# EAGLE design SparkFun_Air_Quality_ENS160_Qwiic_Micro (EAGLE 9.6.2)
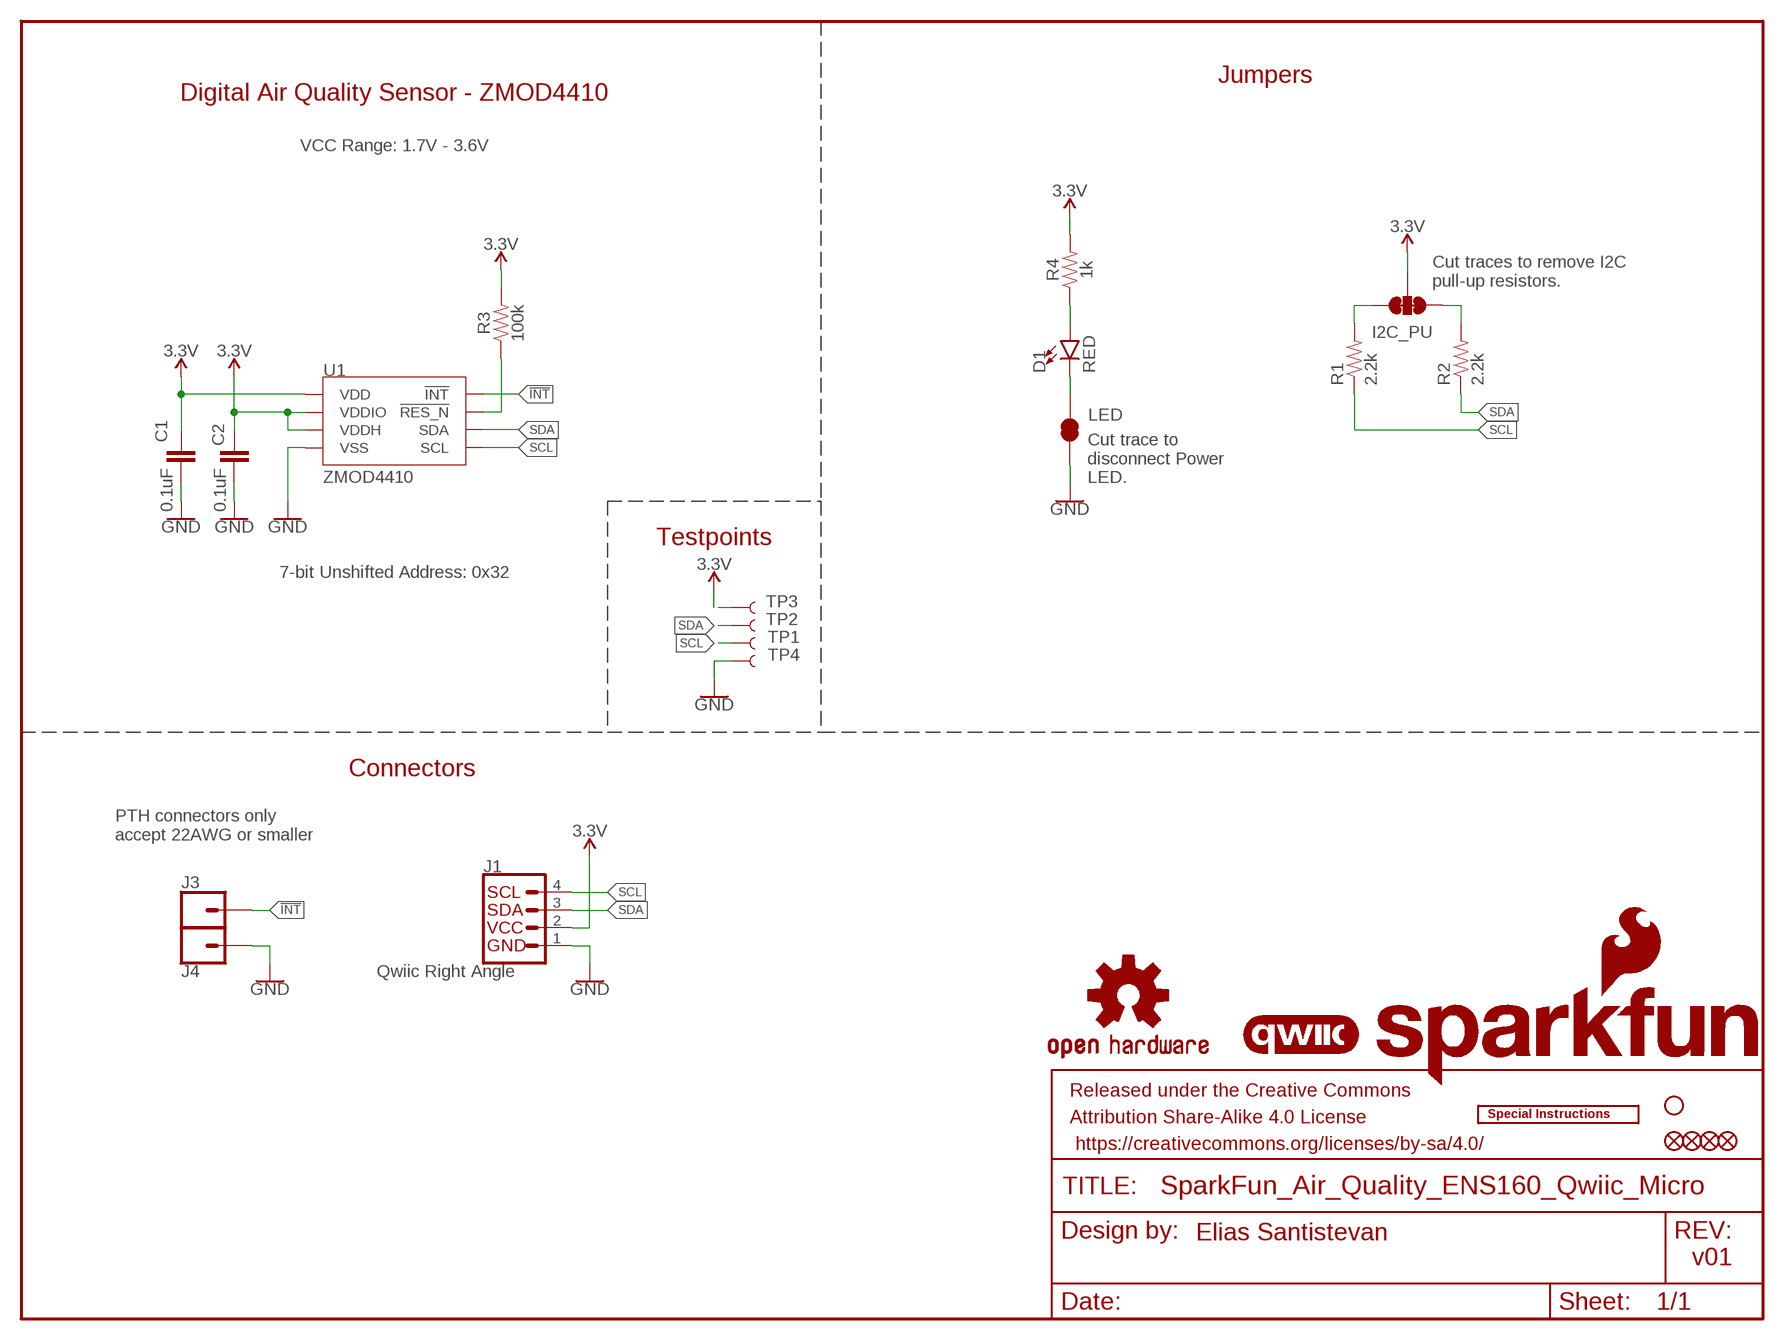
[diagram p0: schematic, sheet 1]

## Parts
C1  0.1uF  0.1UF-0402T-16V-10%  [0402-TIGHT]
C2  0.1uF  0.1UF-0402T-16V-10%  [0402-TIGHT]
D1  RED  LED-RED_0402  [LED-0402]
FD1  FIDUCIALUFIDUCIAL  [FIDUCIAL-MICRO]
FD2  FIDUCIALUFIDUCIAL  [FIDUCIAL-MICRO]
FID1  FIDUCIALUFIDUCIAL  [FIDUCIAL-MICRO]
FID2  FIDUCIALUFIDUCIAL  [FIDUCIAL-MICRO]
FRAME1  FRAME-LETTER  [CREATIVE_COMMONS]
I2C_PU  S_MODE  JUMPER-SMT_3_2-NC_TRACE_SILK  [SMT-JUMPER_3_2-NC_TRACE_SILK]
J1  Qwiic Right Angle  I2C_STANDARDQWIIC  [JST04_1MM_RA]
J3  CONN_01_1MM  [1X01_1MM_NO_SILK]
J4  CONN_01_1MM  [1X01_1MM_NO_SILK]
LED  JUMPER-SMT_2_NC_TRACE_SILK  [SMT-JUMPER_2_NC_TRACE_SILK]
LOGO1  QWIIC_LOGO_3MM  [QWIIC_3MM]
LOGO2  OSHW-LOGOMINI  [OSHW-LOGO-MINI]
LOGO3  SFE_LOGO_NAME_FLAMEBLANK  [BLANK]
LOGO4  SPECIAL_INSTRUCTIONS-PRODUCTION  [PRODUCTION_INSTRUCTIONS]
R1  2.2k  2.2KOHM-0402T-1/16W-1%  [0402-TIGHT]
R2  2.2k  2.2KOHM-0402T-1/16W-1%  [0402-TIGHT]
R3  100k  100KOHM-0402T-1/16W-1%  [0402-TIGHT]
R4  1k  1KOHM-0402T-1/16W-1%  [0402-TIGHT]
STANDOFF1  STAND-OFFTIGHT  [STAND-OFF-TIGHT]
TP1  TEST-POINT3  [PAD.03X.03]
TP2  TEST-POINT3  [PAD.03X.03]
TP3  TEST-POINT3  [PAD.03X.03]
TP4  TEST-POINT3  [PAD.03X.03]
U1  ZMOD4410  [LGA-12]

## Nets
3.3V: C1.1 C2.1 I2C_PU.2 J1.2 R3.2 R4.2 TP3.1 U1.P5(VDD) U1.P10(VDDH) U1.P12(VDDIO)
!INT!: J3.1 U1.P3(!INT!)
!RESET!: R3.1 U1.P11(!RES_N!)
GND: C1.2 C2.2 J1.1 J4.1 LED.1 TP4.1 U1.P6(VSS) U1.P7(VSS) U1.P9(VSS)
N$2: D1.A R4.1
N$3: D1.C LED.2
N$5: I2C_PU.1 R1.2
N$6: I2C_PU.3 R2.2
SCL: J1.4 R1.1 TP1.1 U1.P1(SCL)
SDA: J1.3 R2.1 TP2.1 U1.P2(SDA)

## Notes on the sheet
- Jumpers
- Digital Air Quality Sensor - ZMOD4410
- VCC Range: 1.7V - 3.6V
- Cut traces to remove I2C
  pull-up resistors.
- Cut trace to
  disconnect Power
  LED.
- Testpoints
- 7-bit Unshifted Address: 0x32
- Connectors
- PTH connectors only 
  accept 22AWG or smaller
- Elias Santistevan
- v01

## Library data of the parts
C1 C2 = SparkFun-Capacitors:0.1UF: 0.1µF ceramic capacitors A capacitor is a passive two-terminal electrical component used to store electrical energy temporarily in an electric field.; PROD_ID: CAP-12416
D1 = SparkFun-LED:LED-RED: Red SMD LED Used in manufacturing of most products at SparkFun Packages: 0603 - SMD 0603 package [Product Link] <http://docs.avagotech.com/docs/AV02-0551EN> 0603 SMART - SMD 0603 SMART package ( more efficient and expensive)[Product Link] <http://www.osram-os.com/Graphics/XPic2/00077099_0.pdf> 1206 - SMD1206 package [Product Link] <https://www.sparkfun.com/datasheets/DevTools/LilyPad/Q150OVS4.pdff> SparkFun Products: Pro Mini 328 -5V <https://www.sparkfun.com/products/821> RedBoard <https://www.sparkfun.com/products/12757> IOIO-OTG <https://www.sparkfun.com/products/13613>; PROD_ID: DIO-16757
FD1 FD2 FID1 FID2 = SparkFun-Aesthetics:FIDUCIAL: Fiducial Alignment Points Point-of-reference for pick-and-place machines and other optical instruments.
FRAME1 = SparkFun-Aesthetics:FRAME-LETTER: Schematic Frame - Letter Standard 8.5x11 US Letter frame; DESIGNER: Elias Santistevan
I2C_PU = SparkFun-Jumpers:JUMPER-SMT_3_2-NC_TRACE: Normally closed trace jumper (2 of 2 connections) This jumper has a trace between all three pads so they are normally closed (NC). Use a razor knife to open the connection(s). For best results follow the IPC guidelines for cutting traces: Cutout at least 0.063 mm (0.005 in). Remove all loose material to clean up the cut area. Seal the cut with an approved epoxy. Reapply solder to reclose the connection(s).
J1 = SparkFun-Connectors:I2C_STANDARD: SparkFun I2C Standard Pinout Header SparkFun has standardized on a pinout for all I2C based sensor breakouts. This pinout allows I2C boards to be plugged directly into the headers on Arduino Uno compatible boards, and to be daisy chained easily. Example SparkFun Products: SparkFun Atmospheric Sensor Breakout - BME280 <https://www.sparkfun.com/products/13676> SparkFun Altitude/Pressure Sensor Breakout - MPL3115A2 <https://www.sparkfun.com/products/11084> SparkFun TOF Range Finder Sensor - VL6180 <https://www.sparkfun.com/products/12785>; PROD_ID: CONN-13694
J3 J4 = SparkFun-Connectors:CONN_01: Single connection point. Often used as Generic Header-pin footprint for 0.1 inch spaced/style header connections On any of the 0.1 inch spaced packages, you can populate with these: Break Away Headers - Straight <https://www.sparkfun.com/products/116> (PRT-00116) Break Away Male Headers - Right Angle <https://www.sparkfun.com/products/553> (PRT-00553) Female Headers <https://www.sparkfun.com/products/115> (PRT-00115) Break Away Headers - Machine Pin <https://www.sparkfun.com/products/117> (PRT-00117) Break Away Female Headers - Swiss Machine Pin <https://www.sparkfun.com/products/743> (PRT-00743) This device is also useful as a general connection point to wire up your design to another part of your project. Our various solder wires solder well into these plated through hole pads. Hook-Up Wire - Assortment (Stranded, 22 AWG) <https://www.sparkfun.com/products/11375> (PRT-11375) Hook-Up Wire - Assortment (Solid Core, 22 AWG) <https://www.sparkfun.com/products/11367> (PRT-11367) View the entire wire category on our website here <https://www.sparkfun.com/categories/141> Special notes: SMTSO-256-ET is a "flush mount" nut for a 4-40 screw. We mostly use this on specialty testbeds; it is a nice way to connect hardware to your PCB at an adjustable hieght. Also note, the SNAP packages are for using a snappable style connector. We sell a baggie of snaps and they are also used on two LilyPad designs: Snap Assortment - 30 pack (male and female) <https://www.sparkfun.com/products/11347> (DEV-11347) LilyPad Arduino SimpleSnap <https://www.sparkfun.com/products/10941> (DEV-10941) LilyPad SimpleSnap Protoboard <https://www.sparkfun.com/products/10940> (DEV-10940)
LED = SparkFun-Jumpers:JUMPER-SMT_2_NC_TRACE: Normally closed trace jumper This jumper has a trace between two pads so it's normally closed (NC). Use a razor knife to open the connection. For best results follow the IPC guidelines for cutting traces: Cutout at least 0.063 mm (0.005 in). Remove all loose material to clean up the cut area. Seal the cut with an approved epoxy. Reapply solder to reclose the connection.
LOGO1 = SparkFun-Aesthetics:QWIIC_LOGO: Qwiic Logos for placement on schematic and PCB. The 5.5mm silk logo is best for placing next to Qwiic connector.
LOGO2 = SparkFun-Aesthetics:OSHW-LOGO: Open-Source Hardware (OSHW) Logo This logo indicates the piece of hardware it is found on incorporates a OSHW license and/or adheres to the definition of open source hardware found here: http://freedomdefined.org/OSHW
LOGO3 = SparkFun-Aesthetics:SFE_LOGO_NAME_FLAME: SparkFun Font Logo w/ Flame This is the SparkFun full logo. The logo on the schematic will always be the same size; the package variant is the height of the flame part of the logo. Default layer for the logo on the board is tSilk.
LOGO4 = SparkFun-Aesthetics:SPECIAL_INSTRUCTIONS: Special Ordering/Production Instructions Alert Symbol for special PCB ordering instructions or unique production process warnings. Ordering Instructions Production Instructions Types of information that should be added to box: Copper weight Soldermask color Silk color PCB thickness Number of layers PCB Standard: 1.6mm FR4 1 oz copper immersion silver plating red soldermask white silkscreen Types of information that should be added to box: Special wash requirements Depaneling instructions Humidification Glue curing Default text settings: 0.07 inch 9% ratio 50% line distance
R1 R2 = SparkFun-Resistors:2.2KOHM: 2.2kΩ resistor A resistor is a passive two-terminal electrical component that implements electrical resistance as a circuit element. Resistors act to reduce current flow, and, at the same time, act to lower voltage levels within circuits. - Wikipedia; PROD_ID: RES-14341
R3 = SparkFun-Resistors:100KOHM: 100kΩ resistor A resistor is a passive two-terminal electrical component that implements electrical resistance as a circuit element. Resistors act to reduce current flow, and, at the same time, act to lower voltage levels within circuits. - Wikipedia; PROD_ID: RES-13495
R4 = SparkFun-Resistors:1KOHM: 1kΩ resistor A resistor is a passive two-terminal electrical component that implements electrical resistance as a circuit element. Resistors act to reduce current flow, and, at the same time, act to lower voltage levels within circuits. - Wikipedia; PROD_ID: RES-14342
STANDOFF1 = SparkFun-Hardware:STAND-OFF: Stand Off Drill holes for mechanically mounting via screws, standoffs, etc. Note: Use the keepout ring to avoid running the screw head into surrounding components. Variant Overviews STAND-OFF - Mechanical footprint for a #4 phillips button head screw. STAND-OFF-TIGHT - Mechanical footprint for a #4 phillips button head screw, Example SparkFun Products Screw - Phillips Head (1/4", 4-40, 10 pack) <https://www.sparkfun.com/products/10453> (PRT-10453) Screw - Phillips Head (1/2", 4-40, 10 pack) <https://www.sparkfun.com/products/10452> (PRT-10452) Screw - Phillips Head (3/4", 4-40, 10 pack) <https://www.sparkfun.com/products/10451> (PRT-10451) Screw - Phillips Head (1", 4-40, 10 pack) <https://www.sparkfun.com/products/10450> (PRT-10450)
TP1-TP4 = SparkFun-Connectors:TEST-POINT: SparkFun Test Points Bare copper test points for troubleshooting or In-Circuit-Testing. These are used by our Production team for verifying production board runs using pogo-pins on test beds. SparkFun Products: SparkFun LSM9DS1 Breakout <https://www.sparkfun.com/products/13284> SparkFun PSOC <https://www.sparkfun.com/products/13714> SparkFun Load Cell Amplifier <https://www.sparkfun.com/products/13879>
U1 = ZMOD4410:ZMOD4410: Renesas ZMOD4410 - Digital Air Quality Sensor he ZMOD4410 Gas Sensor Module is designed for easy implementation to detect total volatile organic compounds (TVOC), estimate CO 2, and monitor indoor air quality (IAQ). SparkFun Products: SparkFun Air Quality Sensor - ZMOD4410 (Qwiic) <https://www.sparkfun.com/products/20778> SparkFun Air Quality Sensor - ZMOD4410 (Qwiic Micro) <https://www.sparkfun.com/products/20779>; PROD_ID: IC-17060

## Board
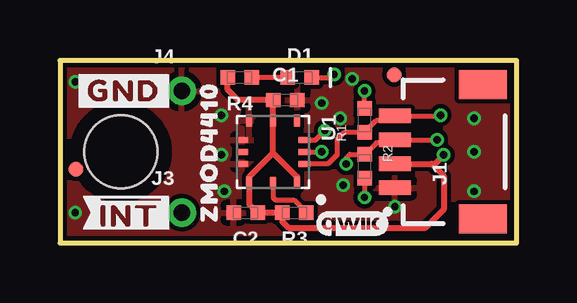
[diagram p1: board, top side]
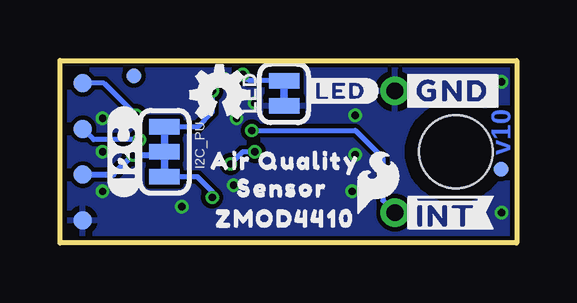
[diagram p2: board, bottom side, seen from below]

Size 19.05 x 7.62 mm. Coordinates in mm from the lower left corner, seen from the top.
Outline: 19.05,7.62 0,7.62 0,0 19.05,0 19.05,7.62
Copper layers (1*16): Top 0.035mm / dielectric 1.5mm / Bottom 0.035mm
Design rules "SparkFun-2-Layer-Minimum-JLCPCB": minimum track width 5mil, minimum drill 0.3mm, track to track 5mil, track to pad 5mil, pad to pad 5mil, via to via 5mil, smd to smd 5mil, copper to edge 7mil, drill to drill 7mil, minimum pad ring 5mil, minimum via ring 5mil, stop-mask expansion 2.5mil, vias tented up to drill 25mil, thermal gap 10mil
tRestrict: area 8.3,4.2 to 8.5,5.1

### Footprints (pad centres in the part's own frame; a part is rotated, then mirrored left to right if it is on the bottom)
0402-TIGHT = smd 0.6 x 0.6: 1 -0.5,0; 2 0.5,0
LED-0402 = smd 0.6 x 0.6: A -0.5,0; C 0.5,0
FIDUCIAL-MICRO = smd 0.635 x 0.635: 1 0,0
SMT-JUMPER_3_2-NC_TRACE_SILK = smd 0.66 x 1.27: 1 -1.041,0; 2 0,0; 3 1.041,0
JST04_1MM_RA = smd 0.6 x 1.35: 1 -1.5,0; 2 -0.5,0; 3 0.5,0; 4 1.5,0 | smd 1.2 x 2: NC1 2.8,-3.675; NC2 -2.8,-3.675
1X01_1MM_NO_SILK = drill 0.7 pad 1.2: 1 0,0
SMT-JUMPER_2_NC_TRACE_SILK = smd 0.66 x 1.27: 1 -0.521,0; 2 0.521,0
STAND-OFF-TIGHT = hole 3.048: 0,0
PAD.03X.03 = smd 0.762 x 0.762: 1 0,0
LGA-12 = smd 0.25 x 0.5: P1 0.5,1.3; P2 0,1.3; P3 -0.5,1.3; P7 -0.5,-1.3; P8 0,-1.3; P9 0.5,-1.3 | smd 0.5 x 0.25: P4 -1.3,1; P5 -1.3,0; P6 -1.3,-1; P10 1.3,-1; P11 1.3,0; P12 1.3,1

### Placement (x,y rotation side)
C1  9.4,5.97 0 top
C2  7.75,1.27 180 top
D1  10.01,6.91 0 top
E$1  [##INT##9]  2.92,1.27 0 top
E$2  [##INT##6]  2.92,1.27 0 bottom
FD1  15.98,6.99 0 bottom
FD2  0.66,3.07 0 bottom
FID1  13.94,7.01 0 top
FID2  0.66,3.07 0 top
FRAME1  -21.59,-22.86 0 top  (outside the outline)
I2C_PU  14.69,3.81 270 bottom
J1  13.97,3.81 90 top
J3  5.08,1.27 0 top
J4  5.08,6.35 0 top
LED  9.7,6.25 90 bottom
LOGO1  12.19,0.81 0 top
LOGO2  12.4,6.2 0 bottom
LOGO3  -39.37,-15.24 0 top  (outside the outline)
LOGO4  34.29,46.99 0 top  (outside the outline)
R1  12.71,5.13 90 top
R2  12.71,3.2 270 top
R3  9.78,1.27 180 top
R4  7.49,6.91 180 top
STANDOFF1  2.54,3.81 0 top
TP1  18.1,6.67 270 bottom
TP2  18.1,4.76 0 bottom
TP3  18.1,2.86 0 bottom
TP4  18.1,0.95 0 bottom
U1  8.89,3.81 270 top
U$3  [#LED#2121]  7.34,6.35 0 bottom
U$4  [#GND#4]  2.67,6.35 0 top
U$5  [ZMOD441011]  6.22,3.81 90 top
U$6  [ZMOD441011]  9.65,1.02 0 bottom
U$7  [AIR_QUALITY441012]  9.65,3.43 0 bottom
U$8  [SENSOR441015]  9.78,2.29 0 bottom
U$10  [#GND#4]  2.67,6.35 0 bottom
U$12  [#I2C#4]  16.38,3.81 90 bottom
U$29  [SFE_LOGO_FLAME_.1]  5.79,2.54 0 bottom

### Tracks (layer width: path | path; a pad name or v marks a point on that pad's centre or on a via)
3.3V  (via drill 0.3)
  Top 0.254: J1.2 15.5,3.31 | 15.5,3.31 15.63,3.31 v16,3.68 | 15.5,3.31 15.49,3.3 16,2.79 16,1.4 15.24,0.64 9.53,0.64 9.28,0.89 R3.2 C2.1 7.89,1.63 U1.P10 7.89,2.76 8.89,3.76 | U1.P12 9.89,2.76 8.89,3.76 | 8.89,3.76 U1.P5 C1.1 7.42,5.97 6.99,6.4 R4.2
  Bottom 0.254: I2C_PU.2 14.81,3.68 v16,3.68 16.83,2.86 TP3.1
!INT!  (via drill 0.3)
  Top 0.203: U1.P3 10.66,4.31 v11.05,4.7
  Bottom 0.203: v11.05,4.7 6.73,4.7 5.59,3.56 5.59,1.78 J3.1
!RESET!
  Top 0.203: U1.P11 8.89,1.91 9,1.8 9.75,1.8 R3.1
GND  (via drill 0.3)
  other vias: 11.81,2.41 11.68,5.21 12.19,6.86 17.27,5.21 17.27,3.81 17.27,2.16 6.73,5.33 6.73,3.68 13.97,1.52 10.92,5.84 6.86,2.16 0.64,6.73 0.64,1.27
  pour Bottom (isolate 0.178): 19.05,0 19.05,7.62 0,7.62 0,0
  pour Top (isolate 0.178, rank 2): 19.05,0 19.05,7.62 0,7.62 0,0
N$2
  Top 0.203: D1.A R4.1
N$3  (via drill 0.3)
  Top 0.203: D1.C 11.3,6.91 v11.43,7.04
  Bottom 0.203: LED.2 9.72,6.79 11.18,6.79 v11.43,7.04
N$5  (via drill 0.3)
  Top 0.203: R1.2 v12.7,6.35
  Bottom 0.203: v12.7,6.35 12.7,5.46 13.31,4.85 I2C_PU.1
N$6  (via drill 0.3)
  Top 0.203: R2.2 v12.71,1.91 v12.7,1.91
  Bottom 0.203: v12.7,1.91 12.7,2.16 13.31,2.77 I2C_PU.3
SCL  (via drill 0.3)
  Top 0.203: U1.P1 11.18,3.3 11.56,3.68 11.56,4.32 11.87,4.63 R1.1 13.18,5.11 13.77,5.11 J1.4 15.85,5.31 v15.88,5.33
  Bottom 0.203: v15.88,5.33 17.21,6.67 TP1.1
SDA  (via drill 0.3)
  Top 0.203: U1.P2 v10.92,3.81 | v11.94,3.3 11.94,3.56 12.08,3.7 R2.1 13.19,4.18 13.84,4.18 J1.3 v15.72,4.31 v15.73,4.32
  Bottom 0.203: v10.92,3.81 11.43,3.81 v11.94,3.3 | v15.73,4.32 17.65,4.32 TP2.1

### Text on the board
Bottom: v10
Measures: Units in Inches
tDocu: No Clean Assembly